# EAGLE design Puzzle-Encoder v1.1 (EAGLE 6.6.0)
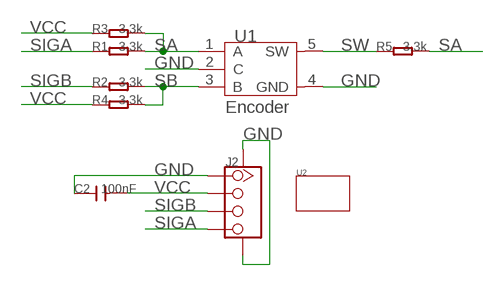
[diagram p0: schematic, sheet 1]

## Parts
C2  100nF  C-0603  [C0603]
J2  TWIG-4P-2.0-SMD-FEMALE-REINFORCE'DD'  [4P-SMD-2.0]
R1  3.3k  R-0603  [R0603]
R2  3.3k  R-0603  [R0603]
R3  3.3k  R-0603  [R0603]
R4  3.3k  R-0603  [R0603]
R5  3.3k  R-0603  [R0603]
U1  Encoder  ROTARY-ENCODE-5P  [5P-13.75X11.7X6.5H]
U2  TWIG'1U'  [1U-DIM-W/-DRILL]

## Nets
GND: C2.1 J2.1 J2.SS1 J2.SS2 U1.2(C) U1.4(GND)
SA: R1.2 R3.2 R5.2 U1.1(A)
SB: R2.2 R4.2 U1.3(B)
SIGA: J2.4 R1.1
SIGB: J2.3 R2.1
SW: R5.1 U1.5(SW)
VCC: C2.2 J2.2 R3.1 R4.1

## Library data of the parts
C2 = Discrete:C*: Ceramic Capacitors
J2 = Connector:TWIG-4P-2.0-SMD-FEMALE-REINFORCE
R1-R5 = Discrete:R*
U1 = template:ROTARY-ENCODE-5P: Rotary Encode With Switch http://www.seeedstudio.com/depot/rotary-encoder-with-switch-p-667.html?cPath=156_160
U2 = moudle:TWIG

## Board
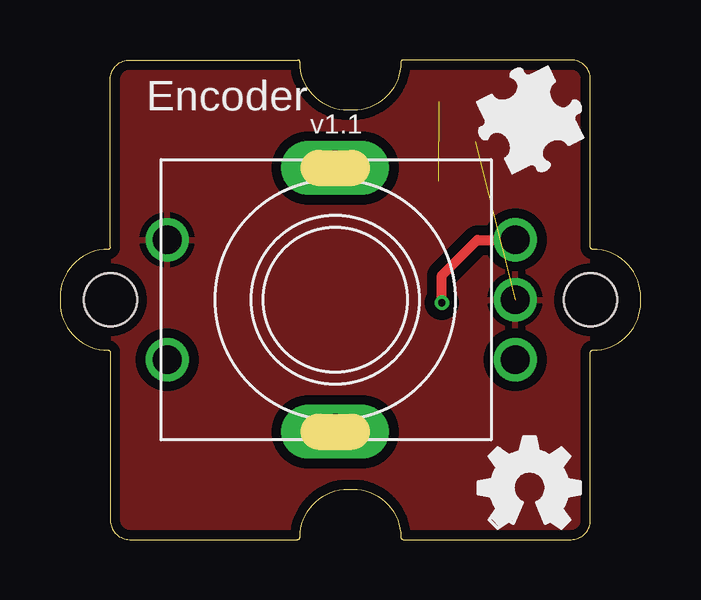
[diagram p1: board, top side]
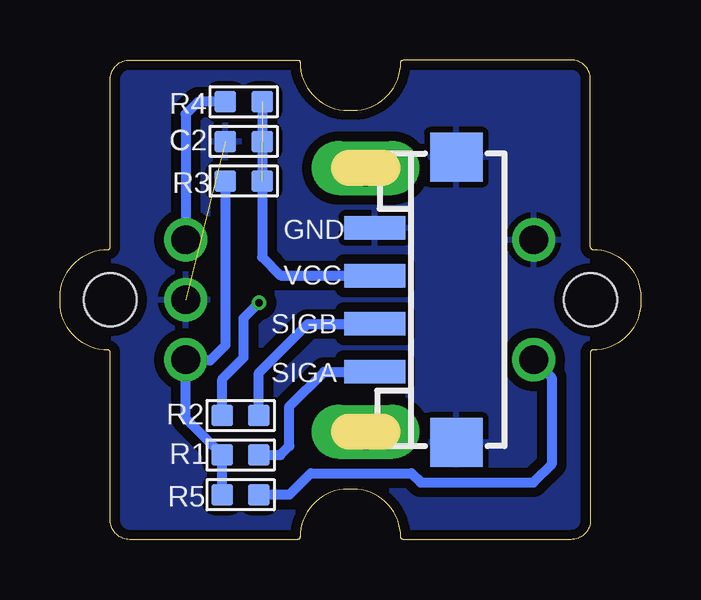
[diagram p2: board, bottom side, seen from below]

Size 24.2 x 20 mm. Coordinates in mm from the lower left corner, seen from the top.
Copper layers (1*16): Top 0.035mm / dielectric 1.5mm / Bottom 0.035mm
Design rules "default *": minimum track width 16mil, minimum drill 12mil, track to track 6mil, track to pad 6mil, pad to pad 6mil, via to via 6mil, smd to smd 0mil, copper to edge 10mil, drill to drill 10mil, minimum pad ring 10mil, minimum via ring 6mil, stop-mask expansion 2mil, vias tented up to drill 100mil, thermal gap 10mil

### Footprints (pad centres in the part's own frame; a part is rotated, then mirrored left to right if it is on the bottom)
C0603 = smd 0.889 x 0.889: 1 -0.762,0; 2 0.762,0
4P-SMD-2.0 = smd 0.965 x 2.54: 1 -3,0; 2 -1,0; 3 1,0; 4 3,0 | smd 2.032 x 2.184: SS1 -5.946,3.4; SS2 5.946,3.4
R0603 = smd 0.889 x 0.889: 1 -0.762,0; 2 0.762,0
5P-13.75X11.7X6.5H = drill 1.2 pad 1.8: 1 -2.5,-7.5; 2 0,-7.5; 3 2.5,-7.5; 4 2.5,7; 5 -2.5,7 | drill 1.5 pad 2 long: P1 -5.5,0; P2 5.5,0
1U-DIM-W/-DRILL = hole 2.2: 0,-10; 0,10

### Placement (x,y rotation side)
C2  16.55,16.6 0 bottom
J2  11.08,10 270 bottom
R1  16.67,3.52 180 bottom
R2  16.67,5.17 180 bottom
R3  16.55,14.95 180 bottom
R4  16.55,18.25 180 bottom
R5  16.67,1.87 180 bottom
U1  11.46,10 90 top
U2  12.1,10 90 top
U$1  [BRICK-LOGO-MIL-0.5]  17.05,14.95 0 top
U$2  [OSHW_FILLX150_NOTEXT]  17.43,0.48 0 top

### Tracks (layer width: path | path; a pad name or v marks a point on that pad's centre or on a via)
GND  (1 unrouted)
  pour Bottom (isolate 0.406): 0.16,20.03 24.29,20.03 24.16,-0.16 0.04,-0.16
  pour Top (isolate 0.406): 0.16,20.03 24.29,20.03 24.16,-0.16 0.04,-0.16
SA
  Bottom 0.406: R3.2 17.31,8.1 17.94,7.46 18.93,7.46 U1.1 18.96,5.05 R1.2 R5.2
SB  (via drill 0.3 pad 0.41)
  Top 0.406: v15.91,9.87 15.91,11.02 17.39,12.5 U1.3
  Bottom 0.406: U1.3 18.96,17.74 18.45,18.25 R4.2 | R2.2 17.43,6.7 16.55,7.59 16.55,9.24 v15.91,9.87
SIGA
  Bottom 0.406: R1.1 15.02,3.52 14.64,3.9 14.64,5.56 13.2,7 J2.4
SIGB
  Bottom 0.406: R2.1 15.91,6.95 13.88,8.98 11.1,8.98 J2.3
SW
  Bottom 0.406: U1.5 3.72,6.75 3.72,3.14 4.48,2.38 9.18,2.38 9.56,2.76 13.75,2.76 14.64,1.87 R5.1
VCC  (2 unrouted)
  Bottom 0.406: R4.1 15.78,11.78 15.02,11.02 11.1,11.02 J2.2

### Text on the board
tPlace: Encoder | v1.1
bPlace: GND | VCC | SIGB | SIGA